# Altium schematic sheet BTL.SchDoc
size A1; SheetNumber: 1; SheetTotal: 1; SPICEModelCacheVQOZSIKY: <root> / <DocumentId>VQOZSIKY</DocumentId> / <CacheFrame Number="0"> / <Model Name="0805_885012207072_100nf" Kind="CKT"> / <Text>******* / .subckt 0805_885012207072_100nF 1 2 / Rser 1 3 0.0172819633028 / Lser 2 4 0.00000000035 / C1 3 4 0.0000001 / Rpar 3 4 5000000000 / .ends 0805_885012207072_100nF</Text> / </Model> / <Model Name="0805_885012007030_22pf" Kind="CKT"> / <Text>******* / .subckt 0805_885012007030_22pF 1 2 / Rser 1 3 0.337501541959 / Lser 2 4 6.08362599E-10 / C1 3 4 0.000000000022 / Rpar 3 4 10000000000 / .ends 0805_885012007030_22pF</Text> / </Model> / <Model Name="0805_885012107015_1uf" Kind="CKT"> / <Text>******* / .subckt 0805_885012107015_1uF 1 2 / Rser 1 3 0.00799934804354 / Lser 2 4 2.55135429E-10 / C1 3 4 0.000001 / Rpar 3 4 500000000 / .ends 0805_885012107015_1uF</Text> / </Model> / <Model Name="0805_885012207068_22nf" Kind="CKT"> / <Text>******* / .subckt 0805_885012207068_22nF 1 2 / Rser 1 3 0.0486328028818 / Lser 2 4 0.00000000041 / C1 3 4 0.000000022 / Rpar 3 4 10000000000 / .ends 0805_885012207068_22nF</Text> / </Model> / <Model Name="0805_885012207078_1uf" Kind="CKT"> / <Text>******* / .subckt 0805_885012207078_1uF 1 2 / Rser 1 3 0.00804838198988 / Lser 2 4 2.69843792E-10 / C1 3 4 0.000001 / Rpar 3 4 500000000 / .ends 0805_885012207078_1uF</Text> / </Model> / </CacheFrame> / </root>
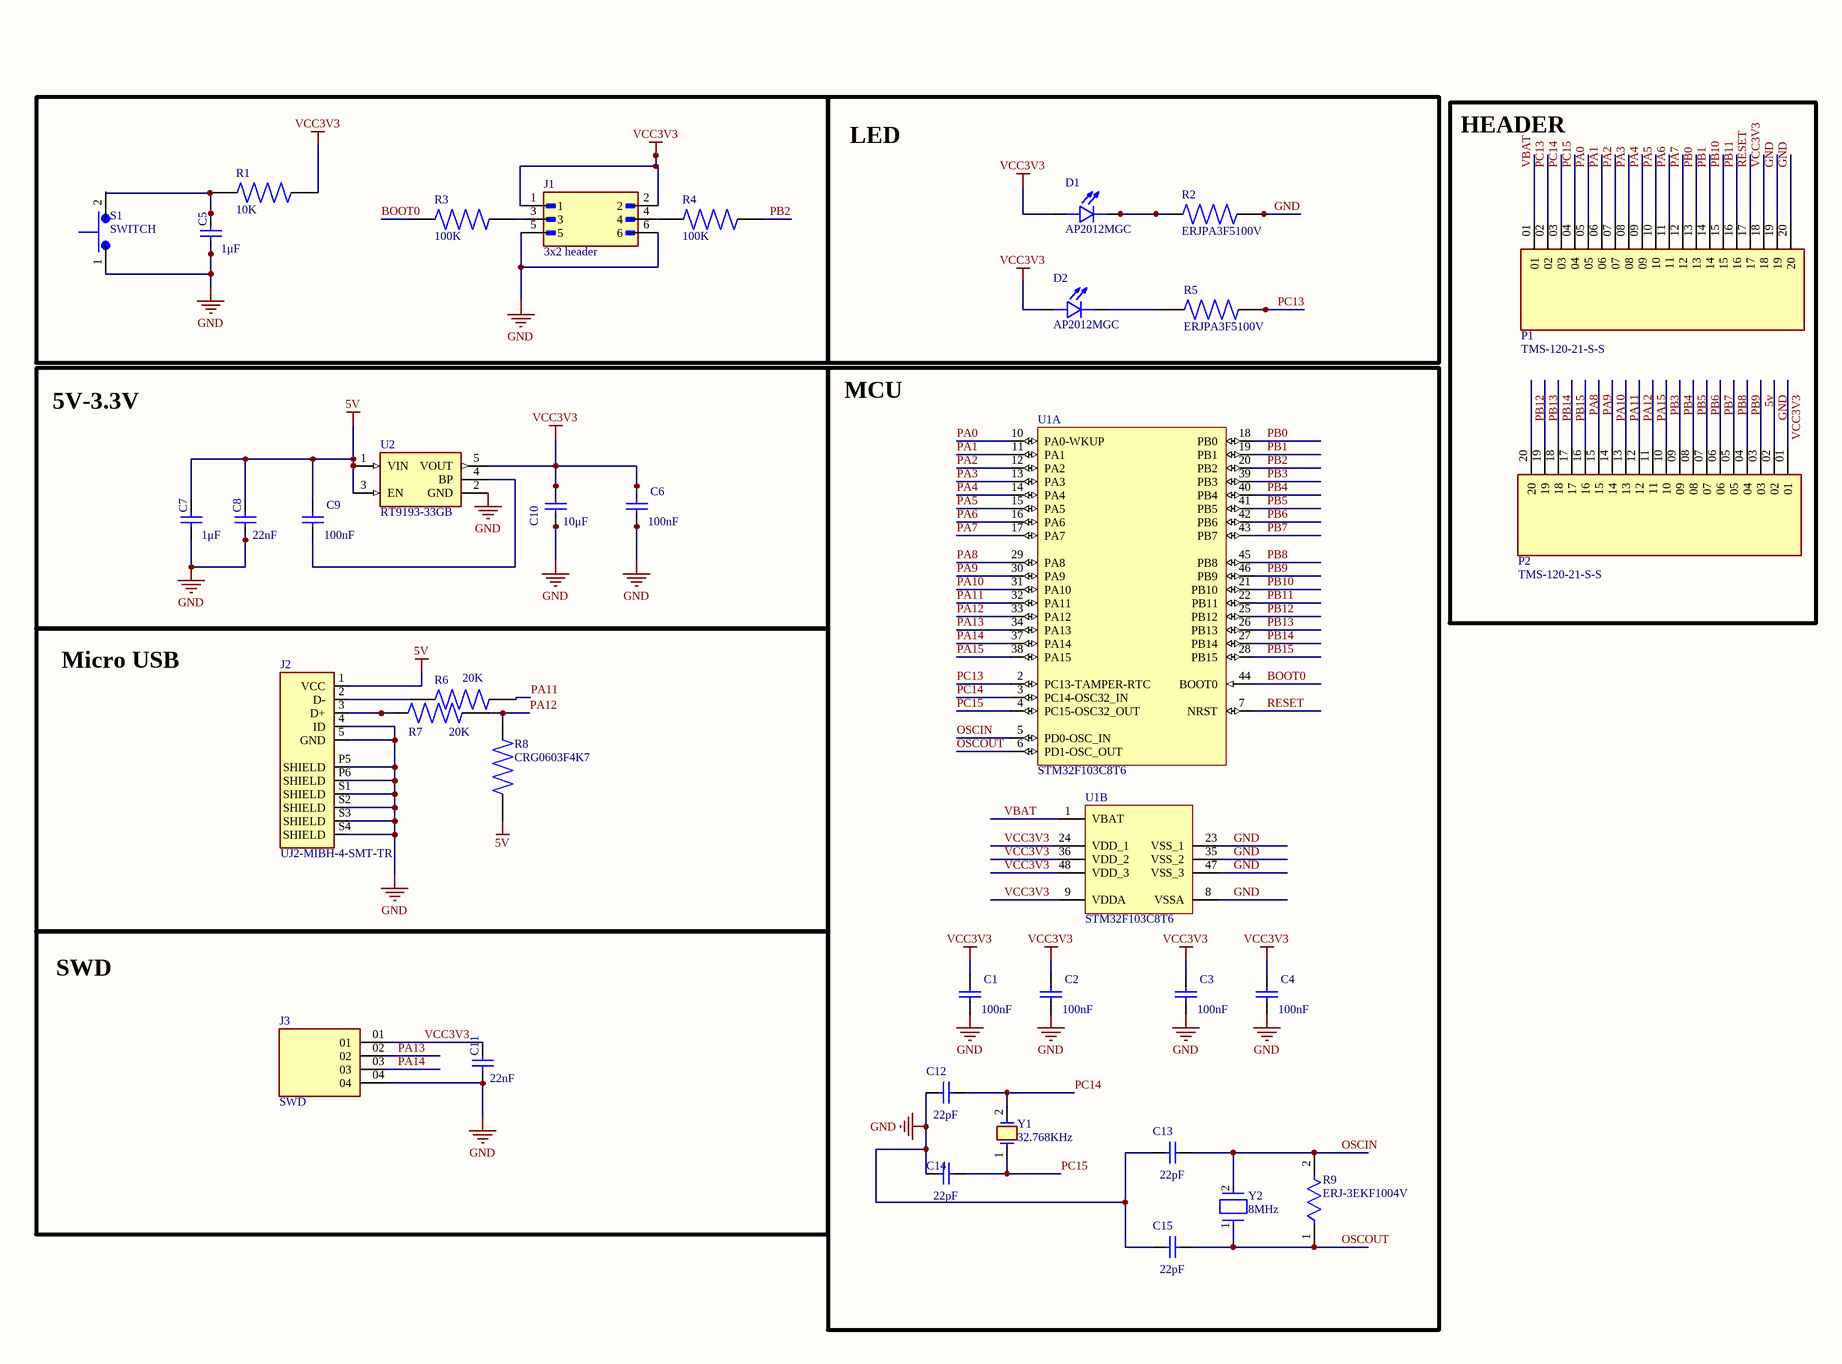
[diagram p0: BTL.SchDoc, left]
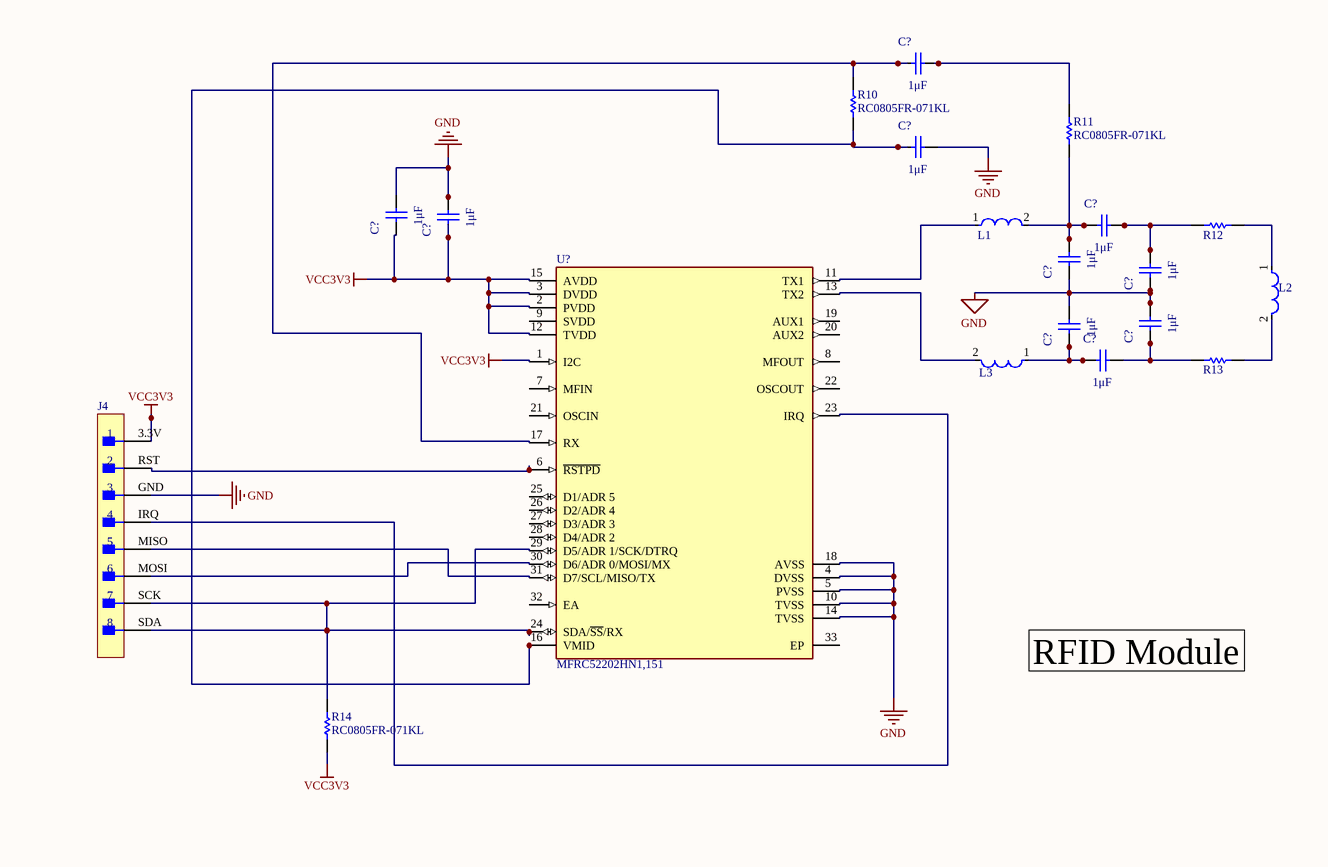
[diagram p1: BTL.SchDoc, right]

## Parts
(Parts that share a designator on the sheet are numbered #1, #2 ... from top to bottom, then left to right.)
C1  100nF  [WCAP-CSGP_0805_L2W1.25H0.8_Reflow]
C2  100nF  [WCAP-CSGP_0805_L2W1.25H0.8_Reflow]
C3  100nF  [WCAP-CSGP_0805_L2W1.25H0.8_Reflow]
C4  100nF  [WCAP-CSGP_0805_L2W1.25H0.8_Reflow]
C5  1μF  [WCAP-CSGP_0805_L2W1.25H1.25]
C6  100nF  [WCAP-CSGP_0805_L2W1.25H0.8_Reflow]
C7  1μF  [WCAP-CSGP_0805_L2W1.25H1.25]
C8  22nF  [WCAP-CSGP_0805_L2W1.25H0.8_Reflow]
C9  100nF  [WCAP-CSGP_0805_L2W1.25H0.8_Reflow]
C10  10μF  [WCAP-CSGP_0805_L2W1.25H1.25]
C11  22nF  [WCAP-CSGP_0805_L2W1.25H0.8_Reflow]
C12  22pF  [WCAP-CSGP_0805_L2W1.25H0.6_Reflow]
C13  22pF  [WCAP-CSGP_0805_L2W1.25H0.6_Reflow]
C14  22pF  [WCAP-CSGP_0805_L2W1.25H0.6_Reflow]
C15  22pF  [WCAP-CSGP_0805_L2W1.25H0.6_Reflow]
C?#1  1μF  [WCAP-CSGP_0805_L2W1.25H1.25]
C?#2  1μF  [WCAP-CSGP_0805_L2W1.25H1.25]
C?#3  1μF  [WCAP-CSGP_0805_L2W1.25H1.25]
C?#4  1μF  [WCAP-CSGP_0805_L2W1.25H1.25]
C?#5  1μF  [WCAP-CSGP_0805_L2W1.25H1.25]
C?#6  1μF  [WCAP-CSGP_0805_L2W1.25H1.25]
C?#7  1μF  [WCAP-CSGP_0805_L2W1.25H1.25]
C?#8  1μF  [WCAP-CSGP_0805_L2W1.25H1.25]
C?#9  1μF  [WCAP-CSGP_0805_L2W1.25H1.25]
C?#10  1μF  [WCAP-CSGP_0805_L2W1.25H1.25]
D1  AP2012MGC  [LED_AP2012MGC]
D2  AP2012MGC  [LED_AP2012MGC]
J1  3x2 header  [HARWIN_M20-9980346]
J2  UJ2-MIBH-4-SMT-TR  [CUIDEVICES_UJ2-MIBH-4-SMT-TR]
J3  SWD  [SAMTEC_TSW-204-16-G-S-RA]
J4  53047-0810  [53047-0810_MFG]  (value not drawn)
L1  CBC3225T102KR  [FP-CB3225-IPC_B]  (value not drawn)
L2  CBC3225T102KR  [FP-CB3225-IPC_B]  (value not drawn)
L3  CBC3225T102KR  [FP-CB3225-IPC_B]  (value not drawn)
P1  TMS-120-21-S-S  [SAMTEC_TMS-120-21-S-S]
P2  TMS-120-21-S-S  [SAMTEC_TMS-120-21-S-S]
R1  10K  [RESC2012X60N]
R2  ERJPA3F5100V  [RES_ERJPA3F5100V]
R3  100K  [RESC2012X60N]
R4  100K  [RESC2012X60N]
R5  ERJPA3F5100V  [RES_ERJPA3F5100V]
R6  20K  [RESC2012X60N]
R7  20K  [RESC2012X60N]
R8  CRG0603F4K7  [RESC1608X55N]
R9  ERJ-3EKF1004V  [FP-ERJ3EK-IPC_C]
R10  RC0805FR-071KL  [RESC2013X60X35ML10T20]
R11  RC0805FR-071KL  [RESC2013X60X35ML10T20]
R12  RC0805FR-071KL  [RESC2013X60X35ML10T20]  (value not drawn)
R13  RC0805FR-071KL  [RESC2013X60X35ML10T20]  (value not drawn)
R14  RC0805FR-071KL  [RESC2013X60X35ML10T20]
S1  SWITCH  [SW_TS10-63-26-BE-250-SMT-TR]
U1  STM32F103C8T6  [STM-LQFP48_L]  (parts A,B of 2)
U2  RT9193-33GB  [SOT94P279X129-5N]
U?  MFRC52202HN1,151  [FP-SOT617-1-MFG]
Y1  32.768KHz  [XTAL_NX3215SA-32.768K-STD-MUA-14]
Y2  8MHz  [FP-ABLS-MFG]

## Blocks framed on the sheet
LED: D1 D2 R2 R5
HEADER: P1 P2
5V-3.3V: C6-C10 U2
MCU: C1-C4 C12-C15 R9 U1 Y1 Y2
Micro USB: J2 R6-R8
SWD: C11 J3

## Nets
5v: C7.2 C8.2 C9.2 J2.1(VCC) P2.03 R8.1 U2.1(VIN) U2.3(EN)
GND: C1.1 C2.1 C3.1 C4.1 C5.1 C6.1 C7.1 C8.1 C10.1 C11.1 C12.1 C13.1 C14.1 C15.1 C?#2.2 C?#4.2 C?#5.2 C?#6.1 C?#7.1 C?#8.2 C?#9.2 J1.5 J1.6 J2.4(ID) J2.5(GND) J2.P5(SHIELD) J2.P6(SHIELD) J2.S1(SHIELD) J2.S2(SHIELD) J2.S3(SHIELD) J2.S4(SHIELD) J3.04 J4.GND P1.19 P1.20 P2.02 R2.2 S1.1 U1.8(VSSA) U1.23(VSS_1) U1.35(VSS_2) U1.47(VSS_3) U2.2(GND) U?.4(DVSS) U?.5(PVSS) U?.10(TVSS) U?.14(TVSS) U?.18(AVSS)
VCC3V3: C1.2 C2.2 C3.2 C4.2 C6.2 C10.2 C11.2 C?#4.1 C?#5.1 D1.A D2.A J1.1 J1.2 J3.01 J4.3.3V P1.18 P2.01 R1.1 R14.1 U1.9(VDDA) U1.24(VDD_1) U1.36(VDD_2) U1.48(VDD_3) U2.5(VOUT) U?.1(I2C) U?.2(PVDD) U?.3(DVDD) U?.12(TVDD) U?.15(AVDD)
BOOT0: R3.1 U1.44(BOOT0)
OSCIN: C13.2 R9.2 U1.5(PD0-OSC_IN) Y2.2
OSCOUT: C15.2 R9.1 U1.6(PD1-OSC_OUT) Y2.1
PA0: P1.05 U1.10(PA0-WKUP)
PA1: P1.06 U1.11(PA1)
PA2: P1.07 U1.12(PA2)
PA3: P1.08 U1.13(PA3)
PA4: P1.09 U1.14(PA4)
PA5: P1.10 U1.15(PA5)
PA6: P1.11 U1.16(PA6)
PA7: P1.12 U1.17(PA7)
PA8: P2.16 U1.29(PA8)
PA9: P2.15 U1.30(PA9)
PA10: P2.14 U1.31(PA10)
PA11: P2.13 R6.2 U1.32(PA11)
PA12: P2.12 R7.2 R8.2 U1.33(PA12)
PA13: J3.02 U1.34(PA13)
PA14: J3.03 U1.37(PA14)
PA15: P2.11 U1.38(PA15)
PB0: P1.13 U1.18(PB0)
PB1: P1.14 U1.19(PB1)
PB2: R4.2 U1.20(PB2)
PB3: P2.10 U1.39(PB3)
PB4: P2.09 U1.40(PB4)
PB5: P2.08 U1.41(PB5)
PB6: P2.07 U1.42(PB6)
PB7: P2.06 U1.43(PB7)
PB8: P2.05 U1.45(PB8)
PB9: P2.04 U1.46(PB9)
PB10: P1.15 U1.21(PB10)
PB11: P1.16 U1.22(PB11)
PB12: P2.20 U1.25(PB12)
PB13: P2.19 U1.26(PB13)
PB14: P2.18 U1.27(PB14)
PB15: P2.17 U1.28(PB15)
PC13: P1.02 R5.2 U1.2(PC13-TAMPER-RTC)
PC14: C12.2 P1.03 U1.3(PC14-OSC32_IN) Y1.2
PC15: C14.2 P1.04 U1.4(PC15-OSC32_OUT) Y1.1
RESET: P1.17 U1.7(NRST)
VBAT: P1.01 U1.1(VBAT)
NetC5_2: C5.2 R1.2 S1.2
NetC9_1: C9.1 U2.4(BP)
NetC?#1_1: C?#1.1 R10.2 U?.17(RX)
NetC?#1_2: C?#1.2 R11.2
NetC?#2_1: C?#2.1 R10.1 U?.16(VMID)
NetC?#3_1: C?#3.1 C?#6.2 L1.2 R11.1
NetC?#3_2: C?#3.2 C?#7.2 R12.2
NetC?#8_1: C?#8.1 C?#10.2 R13.2
NetC?#9_1: C?#9.1 C?#10.1 L3.1
NetD1_C: D1.C R2.1
NetD2_C: D2.C R5.1
NetJ1_3: J1.3 R3.2
NetJ1_4: J1.4 R4.1
NetJ2_2: J2.2(D-) R6.1
NetJ2_3: J2.3(D+) R7.1
NetJ4_IRQ: J4.IRQ U?.23(IRQ)
NetJ4_MISO: J4.MISO U?.31(D7/SCL/MISO/TX)
NetJ4_MOSI: J4.MOSI U?.30(D6/ADR_0/MOSI/MX)
NetJ4_RST: J4.RST U?.6(~{RSTPD})
NetJ4_SCK: J4.SCK J4.SDA R14.2 U?.24(SDA/~{SS}/RX) U?.29(D5/ADR_1/SCK/DTRQ)
NetL1_1: L1.1 U?.11(TX1)
NetL2_1: L2.1 R12.1
NetL2_2: L2.2 R13.1
NetL3_2: L3.2 U?.13(TX2)

Not connected (* = marked no-connect by the designer): U? 7(MFIN) 8(MFOUT) 9(SVDD) 19(AUX1) 20(AUX2) 21(OSCIN) 22(OSCOUT) 25(D1/ADR_5) 26(D2/ADR_4) 27(D3/ADR_3) 28(D4/ADR_2) 32(EA) 33(EP)

## Notes on the sheet
- RFID Module

## Library data of the parts
C1-C4 C6 C9 = 885012207072: WCAP-CSGP Multilayer Ceramic Chip Capacitor, General Purpose, size 0805, X7R, 100nF, 25V; Manufacturer: Wurth Elektronik; Case/Size Code: 0805; Capacitance Tolerance: +/-10%; Dissipation Factor: 3.5%; Insulation Resistance: 5GΩ; Technical Reference: X7R0805104K025DFCT10000; Manufacturer Part Number: 885012207072; Category: Multilayer Ceramic Chip Capacitors; Match Code: WCAP-CSGP; ComponentLink1Description: Website Link; ComponentLink1URL: https://www.we-online.com/redexpert/article/885012207072?ad; ComponentLink2Description: Datasheet Link; ComponentLink2URL: https://www.we-online.com/redexpert/spec/885012207072?ad; Mount: Surface Mount; Min Operating Temperature: -55°C; Max Operating Temperature: 125°C; Packaging: Tape and Reel; Length: 2mm; Width: 1.25mm; Height: 0.8mm; Capacitance: 100nF; Ceramic Type: X7R; Rated Voltage (DC): 25V
C5 C7 = 885012107015: WCAP-CSGP Multilayer Ceramic Chip Capacitor, General Purpose, size 0805, X5R, 1μF, 25V; Manufacturer: Wurth Elektronik; Case/Size Code: 0805; Capacitance Tolerance: +/-20%; Dissipation Factor: 5%; Insulation Resistance: 0.5GΩ; Technical Reference: X5R0805105M025DFCT10000; Manufacturer Part Number: 885012107015; Category: Multilayer Ceramic Chip Capacitors; Match Code: WCAP-CSGP; ComponentLink1Description: Website Link; ComponentLink1URL: https://www.we-online.com/redexpert/article/885012107015?ad; ComponentLink2Description: Datasheet Link; ComponentLink2URL: https://www.we-online.com/redexpert/spec/885012107015?ad; Mount: Surface Mount; Min Operating Temperature: -55°C; Max Operating Temperature: 85°C; Packaging: Tape and Reel; Length: 2mm; Width: 1.25mm; Height: 1.25mm; Capacitance: 1μF; Ceramic Type: X5R; Rated Voltage (DC): 25V
C8 C11 = 885012207068: WCAP-CSGP Multilayer Ceramic Chip Capacitor, General Purpose, size 0805, X7R, 22nF, 25V; Manufacturer: Wurth Elektronik; Case/Size Code: 0805; Capacitance Tolerance: +/-10%; Dissipation Factor: 3.5%; Insulation Resistance: 10GΩ; Technical Reference: X7R0805223K025DFCT10000; Manufacturer Part Number: 885012207068; Category: Multilayer Ceramic Chip Capacitors; Match Code: WCAP-CSGP; ComponentLink1Description: Website Link; ComponentLink1URL: https://www.we-online.com/redexpert/article/885012207068?ad; ComponentLink2Description: Datasheet Link; ComponentLink2URL: https://www.we-online.com/redexpert/spec/885012207068?ad; Mount: Surface Mount; Min Operating Temperature: -55°C; Max Operating Temperature: 125°C; Packaging: Tape and Reel; Length: 2mm; Width: 1.25mm; Height: 0.8mm; Capacitance: 22nF; Ceramic Type: X7R; Rated Voltage (DC): 25V
C10 = 885012107027: WCAP-CSGP Multilayer Ceramic Chip Capacitor, General Purpose, size 0805, X5R Class II, 10μF, 25V; Manufacturer: Wurth Elektronik; Case/Size Code: 0805; Capacitance Tolerance: +/-10%; Dissipation Factor: 12.5%; Insulation Resistance: 0.005GΩ; Technical Reference: X5R0805106K025DFCT10000; Manufacturer Part Number: 885012107027; Category: Multilayer Ceramic Chip Capacitors; Match Code: WCAP-CSGP; ComponentLink1Description: Website Link; ComponentLink1URL: https://www.we-online.com/redexpert/article/885012107027?ad; ComponentLink2Description: Datasheet Link; ComponentLink2URL: https://www.we-online.com/redexpert/spec/885012107027?ad; Mount: Surface Mount; Min Operating Temperature: -55°C; Max Operating Temperature: 85°C; Packaging: Tape and Reel; Length: 2mm; Width: 1.25mm; Height: 1.25mm; Capacitance: 10μF; Ceramic Type: X5R Class II; Rated Voltage (DC): 25V
C12-C15 = 885012007030: WCAP-CSGP Multilayer Ceramic Chip Capacitor, General Purpose, size 0805, NP0, 22pF, 25V; Manufacturer: Wurth Elektronik; Case/Size Code: 0805; Capacitance Tolerance: +/-5%; Insulation Resistance: 10GΩ; Q Factor: 840; Technical Reference: NP00805220J025DFCT10000; Manufacturer Part Number: 885012007030; Category: Multilayer Ceramic Chip Capacitors; Match Code: WCAP-CSGP; ComponentLink1Description: Website Link; ComponentLink1URL: https://www.we-online.com/redexpert/article/885012007030?ad; ComponentLink2Description: Datasheet Link; ComponentLink2URL: https://www.we-online.com/redexpert/spec/885012007030?ad; Mount: Surface Mount; Min Operating Temperature: -55°C; Max Operating Temperature: 125°C; Packaging: Tape and Reel; Length: 2mm; Width: 1.25mm; Height: 0.6mm; Capacitance: 22pF; Ceramic Type: NP0; Rated Voltage (DC): 25V
C?#1-C?#10 = 885012207078: WCAP-CSGP Multilayer Ceramic Chip Capacitor, General Purpose, size 0805, X7R, 1μF, 25V; Manufacturer: Wurth Elektronik; Case/Size Code: 0805; Capacitance Tolerance: +/-10%; Dissipation Factor: 5%; Insulation Resistance: 0.5GΩ; Technical Reference: X7R0805105K025DFCT10000; Manufacturer Part Number: 885012207078; Category: Multilayer Ceramic Chip Capacitors; Match Code: WCAP-CSGP; ComponentLink1Description: Website Link; ComponentLink1URL: https://www.we-online.com/redexpert/article/885012207078?ad; ComponentLink2Description: Datasheet Link; ComponentLink2URL: https://www.we-online.com/redexpert/spec/885012207078?ad; Mount: Surface Mount; Min Operating Temperature: -55°C; Max Operating Temperature: 125°C; Packaging: Tape and Reel; Length: 2mm; Width: 1.25mm; Height: 1.25mm; Capacitance: 1μF; Ceramic Type: X7R; Rated Voltage (DC): 25V
D1 D2 = AP2012MGC: Green 2 x 1.25 x 1.1 mm 120Â° Water Clear 70 mcd 2.1 V Chip LED Lamp SMT; MF: Kingbright; SnapEDA_Link: https://www.snapeda.com/parts/AP2012MGC/Kingbright/view-part/?ref=snap; Package: 0805 Kingbright; Value: *; MP: AP2012MGC; Check_prices: https://www.snapeda.com/parts/AP2012MGC/Kingbright/view-part/?ref=eda
J1 = M20-9980346: Package: None; Price: None; Value: *; MP: M20-9980346; Availability: Unavailable
J2 = UJ2-MIBH-4-SMT-TR: Micro B, USB 2.0, 480 Mbps, 30 Vac, 1.8 A, Right Angle, Surface Mount, USB Receptacle; MF: Same Sky; SnapEDA_Link: https://www.snapeda.com/parts/UJ2-MIBH-4-SMT-TR/Same+Sky/view-part/?ref=snap; Package: None; Value: *; MP: UJ2-MIBH-4-SMT-TR; Check_prices: https://www.snapeda.com/parts/UJ2-MIBH-4-SMT-TR/Same+Sky/view-part/?ref=eda
J3 = TSW-204-16-G-S-RA: Connector Header Through Hole, Right Angle 4 position 0.200 (5.08mm); MF: Samtec; SnapEDA_Link: https://www.snapeda.com/parts/TSW-204-16-G-S-RA/Samtec/view-part/?ref=snap; Package: None; Value: *; MP: TSW-204-16-G-S-RA; Check_prices: https://www.snapeda.com/parts/TSW-204-16-G-S-RA/Samtec/view-part/?ref=eda
J4 = 46342ca634edb1a761f196181bcfdd6: Conn Shrouded Header (4 Sides) HDR 8 POS 1.25mm Solder ST Top Entry Thru-Hole PicoBlade Tray; Manufacturer Lifecycle Status: ACTIVE; Gender: Male; Glow Wire Compliant: Non-compliant; Current Rating: 1A; Number of Positions: 8; Contact Resistance: 20mΩ; Insulation Resistance: 100MΩ; Plating: Tin; Voltage Rating (DC): 125V; Number of Circuits: 7; Schedule B: 8536694040, 8536694040; Max Operating Temperature: 85°C; Housing Material: Polyamide; Pitch: 1.25mm; Number of Rows: 1; ComponentLink1URL: http://molex.com; Country of Origin: MX; Case/Package: 0810; Height: 4.4mm; Housing Color: Natural; Flammability Rating: UL94 V-0; Orientation: Vertical; ComponentLink3Description: Manufacturer's Package Drawing; Mount: Through Hole; Min Operating Temperature: -40°C; Number of Pins: 8; Radiation Hardening: No; Contact Plating: Tin; Lead Pitch: 1.25mm; China RoHS: Compliant; ComponentLink1Description: Manufacturer's Website; Lead Free: Lead Free; ComponentLink2Description: Datasheet URL; RoHS: Compliant; Voltage Rating (AC): 125V; ComponentLink3URL: https://www.molex.com/content/dam/molex/molex-dot-com/products/automated/en-us/salesdrawingpdf/530/53047/530470810_sd.pdf?inline; Color: Natural; Number of Contacts: 8; Lifecycle Status: Production; HelpURL: https://www.molex.com/en-us/products/part-detail/530470810#part-details; ComponentLink2URL: https://www.molex.com/en-us/products/part-detail/530470810#part-details; REACH SVHC: Unknown; Contact Material: Tin; Termination: Through Hole; Voltage Rating: 125V
L1-L3 = 725321dda6339637d4d059423bc1c3c: SMD Inductors 1000uH ±10% 0.1A 16.9Ω 1210; Inductance: 1mH; Self Resonant Frequency: 1.6MHz; Saturation Current: 100mA; Shielding: Unshielded; Core Material: Ferrite; Test Frequency: 100kHz; DC Resistance (DCR): 13R; Min Operating Temperature: -40°C; Tolerance: 10%; Length: 0.126inch; Height: 2.5mm; Depth: 2.7mm; Termination: SMD/SMT; Series: CB; Package Quantity: 1000; RoHS Compliant: Yes; Height - Seated (Max): 0.106inch; Packaging: Tape and Reel; Radiation Hardening: No; Current Rating: 100mA; Halogen Free: Halogen Free; Case/Package: 1210; Max DC Current: 100mA; Case Code (Metric): 3225; Width: 0.098inch; Lead Free: Lead Free; Mount: Surface Mount; Max Operating Temperature: 105°C; Case Code (Imperial): 1210; Resistor Type: Wirewound
R1 = RC0805FR-0710KL: 10 kOhms Â±1% 0.125W, 1/8W Chip Resistor 0805 (2012 Metric) Moisture Resistant Thick Film; MF: Yageo; Value: *; SnapEDA_Link: https://www.snapeda.com/parts/RC0805FR-0710KL/Yageo/view-part/?ref=snap; Purchase-URL: https://pricing.snapeda.com/search/part/RC0805FR-0710KL/?ref=eda; Availability: In Stock; Price: None; Package: 2012 Rohm Semiconductor; Check_prices: https://www.snapeda.com/parts/RC0805FR-0710KL/Yageo/view-part/?ref=eda; MP: RC0805FR-0710KL
R2 R5 = ERJPA3F5100V: RES, THICK FILM, 510R, 1%, 0.25W, 0603; MF: Panasonic; MP: ERJ-PA3F5100V; SnapEDA_Link: https://www.snapeda.com/parts/ERJ-PA3F5100V/Panasonic/view-part/?ref=snap; Package: 1608-2 Panasonic; Value: *; Check_prices: https://www.snapeda.com/parts/ERJ-PA3F5100V/Panasonic/view-part/?ref=eda
R3 R4 = RC0805FR-07100KL: 100 kOhms Â±1% 0.125W, 1/8W Chip Resistor 0805 (2012 Metric) Moisture Resistant Thick Film; MF: Yageo; SnapEDA_Link: https://www.snapeda.com/parts/RC0805FR-07100KL/Yageo/view-part/?ref=snap; Package: 2012 Yageo; Value: *; MP: RC0805FR-07100KL; Check_prices: https://www.snapeda.com/parts/RC0805FR-07100KL/Yageo/view-part/?ref=eda
R6 R7 = CR0805-FX-2002ELF: Res 0805 20k 1% 125mW | Bourns CR0805-FX-2002ELF; SnapEDA_Link: https://www.snapeda.com/parts/CR0805-FX-2002ELF/Bourns/view-part/?ref=snap; Package: 0805 Bourns; Value: *; MF: Bourns; MP: CR0805-FX-2002ELF; Check_prices: https://www.snapeda.com/parts/CR0805-FX-2002ELF/Bourns/view-part/?ref=eda
R8 = CRG0603F4K7: Resistor, Thick Film, Res 4.7 Kilohms, Pwr-Rtg 0.1 W, Tol 1%, SMT, 0603 | TE Connectivity CRG0603F4K7; Power_Rating: .1 W; Resistance: 4.7K; Voltage_Rating: 50 V; SnapEDA_Link: https://www.snapeda.com/parts/CRG0603F4K7/TE+Connectivity+Passive+Product/view-part/?ref=snap; Package: 0603; Value: *; MF: TE Connectivity; MP: CRG0603F4K7; EU_RoHS_Compliance: Compliant with Exemptions; Tolerance: 1%; Check_prices: https://www.snapeda.com/parts/CRG0603F4K7/TE+Connectivity+Passive+Product/view-part/?ref=eda
R9 = CMP-1012-00849-3: RES SMD 1M OHM 1% 1/10W 0603; Resistance: 1MR; Voltage Rating: 75V; Temperature Coefficient: 100ppm/°C; Power Rating: 100mW; REACH SVHC: No SVHC; Radiation Hardening: No; Features: Automotive AEC-Q200; Case Code (Metric): 1608; Resistance Tolerance: 1%; Case/Package: 0603; Termination: SMD/SMT; Max Operating Temperature: 155°C; Tolerance: 1%; Size Code: 0603; Case Code (Imperial): 0603; Min Operating Temperature: -55°C; Number of Pins: 2; Mount: Surface Mount; Package Quantity: 1; Military Standard: Not; Voltage Rating (DC): 75V; Depth: 0.8mm; Packaging: Tape and Reel; Width: 0.8mm; Number of Terminations: 2; Length: 1.6mm; Height: 0.022inch; RoHS Compliant: Yes; Resistor Type: Thick Film; Contact Plating: Tin; Lead Free: Lead Free; Series: ERJ; Construction: Rectangular; Max Power Dissipation: 100mW
R10-R14 = RES-2: Chip Resistor, 1 KOhm, +/- 1%, 125 mW, -55 to 155 degC, 0805 (2012 Metric), RoHS, Tape and Reel; Manufacturer: Yageo; Temperature Coefficient: 100ppm/degreesC; Voltage Rating (DC): 150V; Max Power Dissipation: 125mW; Resistance: 1KOhm; Number of Pins: 2; Number of Terminations: 2; Datasheet URL: http://www.yageo.com/NewPortal/yageodocoutput?fileName=/pdf/R-Chip/PYu-RC_Group_51_RoHS_L_5.pdf; Length: 0.079inch; Package Description: 2-Pin Surface Mounted Device, Body 2 x 1.25 mm; Depth: 1.25mm; Height: 0.024inch; Military Standard: Not; Case/Package: 0805; Package Reference: 0805; RoHSCompliant: true; Lead Free: LeadFree; Packaging: TapeandReel; Package Quantity: 1; Datasheet Version: Rev. 5, 10/2016; Tolerance: 1%; Min Operating Temperature: -55degC; Voltage Rating: 150V; Composition: ThickFilm; Case Code (Imperial): 0805; Power Rating: 125mW; Width: 0.049inch; Case Code (Metric): 2012; Manufacturer URL: http://www.yageo.com/; Max Operating Temperature: 155degC; REACH SVHC: Unknown; Termination: SMD/SMT
S1 = TS10-63-26-BE-250-SMT-TR: 6.1 x 3.8 mm, 2.6 mm Actuator Height, 250 gf, Surface Mount, SPST, Tactile Switch; MF: Same Sky; SnapEDA_Link: https://www.snapeda.com/parts/TS10-63-26-BE-250-SMT-TR/Same+Sky/view-part/?ref=snap; Package: None; Value: *; MP: TS10-63-26-BE-250-SMT-TR; Check_prices: https://www.snapeda.com/parts/TS10-63-26-BE-250-SMT-TR/Same+Sky/view-part/?ref=eda
U1 = CMP-0237-00215-3: ARM Cortex-M3 32-bit MCU, 64 KB Flash, 20 KB Internal RAM, 37 I/Os, 48-pin LQFP, -40 to 85 degC, Tray; Supply Voltage(Vcc) min (V): 2; Internal RAM Size (kB): 20; FLASH Size (Prog) (kB): 64; A/D Converter: 2x12-bit (10 Channel); I/Os (High Current): 37; Operating Frequency(F) (Processor speed) (MHz): 72; Core: ARM Cortex-M3; ComponentLink3Description: Package Specification; Mounting Technology: Surface Mount; PartNumber: STM32F103C8T6; PackageReference: LQFP48; Packing: Tray; ComponentLink3URL: http://www.st.com/st-web-ui/static/active/en/resource/technical/document/datasheet/DM00058181.pdf; DatasheetVersion: Rev. 16; ComponentLink1URL: http://www.st.com/web/en/home.html; PackageVersion: Rev. 6, 06/2013; ComponentLink2URL: http://www.st.com/st-web-ui/static/active/en/resource/technical/document/datasheet/CD00161566.pdf; ComponentLink1Description: Manufacturer URL; ComponentLink2Description: Datasheet; PackageDescription: 48-Pin Low Profile Quad Flat Package, 7 x 7 mm Body, 0.5 mm Pitch
U2 = RT9193-33GB: Linear Voltage Regulator IC Positive Fixed 1 Output 300mA TSOT-23-5; MF: Richtek USA; SnapEDA_Link: https://www.snapeda.com/parts/RT9193-33GB/Richtek+USA+Inc./view-part/?ref=snap; Package: SOT-23-5 Richtek; MP: RT9193-33GB; Check_prices: https://www.snapeda.com/parts/RT9193-33GB/Richtek+USA+Inc./view-part/?ref=eda; Purchase-URL: https://pricing.snapeda.com/search/part/RT9193-33GB/?ref=eda; Digi-Key_Part_Number: 1028-1014-2-ND; Value: *
U? = CMP-10150-000005-1: IC RFID READER 13.56MHZ 32HVQFN; Manufacturer: NXP; Nominal Supply Current: 3-60mA; Interface: I2C,SPI,UART,RS-232; Max Supply Voltage: 3.6V; Max Junction Temp: +100°C; Standoff Height: 0mm; Data Rate: 10Mbits/s; Min Supply Voltage: 1.6V; Max Power Dissipation: 200mW; Digikey Description: IC RFID READER 13.56MHZ 32HVQFN; Manufacturer Part Number: MFRC52202HN1,151; ComponentLink2URL: https://www.nxp.com/docs/en/data-sheet/MFRC522.pdf; Temperature Range High: +100°C; ComponentLink2Description: Datasheet; Category: IC; Device Class L1: Integrated Circuits (ICs); Device Class L3: Transceivers; Max Frequency: 13.56MHz; Automotive: No; Height: 1mm; Ambient Temperature Range High: +85°C; Temperature: to +100°C; Lead Free: Yes; Mouser Description: RFID Transponders CONTACTLESS READER IC; Device Class L2: RF Semiconductors and Devices; Octopart: https://octopart.com/mfrc52202hn1%2C151-nxp+semiconductors-19647932; Footprint Url: https://www.nxp.com/docs/en/package-information/SOT617-1.pdf; RoHS: TRUE; Package: SOT617-1; Ambient Temperature Range Low: -25°C
Y1 = NX3215SA-32.768K-STD-MUA-14: 32.768kHz Â±20ppm Crystal 6pF 70 kOhms 2-SMD, No Lead  MANUFACTURER: NIHON DEMPA KOGYO; Availability: Unavailable; Package: None; MP: NX3215SA-32.768K-STD-MUA-14; Value: *; Price: None
Y2 = CMP-27762-009874-1: CRYSTAL 8.0000MHZ 18PF SMD; ESR (Equivalent Series Resistance): 80R; Frequency Stability: 50ppm; Tolerance: 20ppm; Min Operating Temperature: -20°C; Lead Free: Lead Free; Operating Frequency: 8 MHz; Width: 4.7mm; Packaging: Tape and Reel; Series: ABLS; Accuracy: 20ppm; Length: 11.4mm; Frequency Tolerance: 20ppm; Termination: SMD/SMT; Number of Pins: 2; Radiation Hardening: No; Depth: 4.7mm; REACH SVHC: No SVHC; Contact Plating: Tin; Load Capacitance: 18pF; Case/Package: SMD/SMT; Mount: Surface Mount; Package Quantity: 1000; Max Operating Temperature: 70°C; Height: 0.165inch; Frequency: 8MHz; Series Resistance: 80R
P1 P2 = TMS-120-21-S-S: Package: None; Price: None; Value: *; MP: TMS-120-21-S-S; Availability: Unavailable